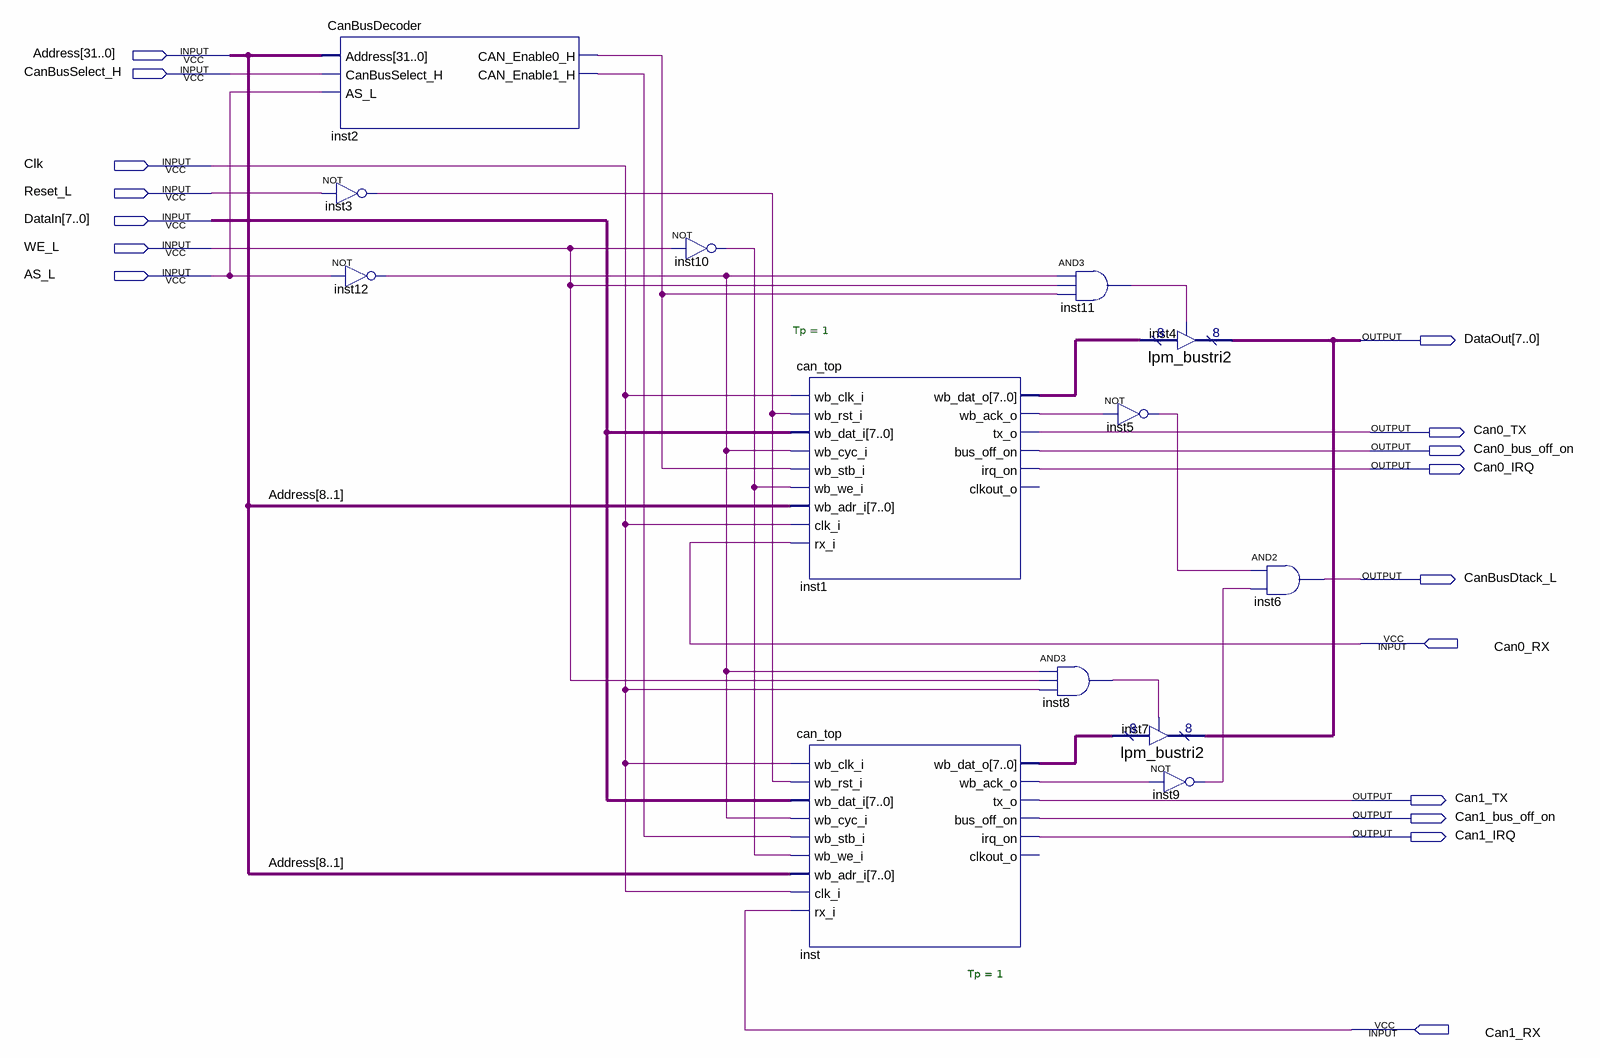
[diagram p0: schematic sheet]
// Quartus schematic CanController.bdf as structural Verilog: 13 symbols, 17 pins
module CanController (
  input  [31:0] Address,
  input  CanBusSelect_H,
  input  Clk,
  input  Reset_L,
  input  [7:0] DataIn,
  input  WE_L,
  input  AS_L,
  input  Can0_RX,
  input  Can1_RX,
  output [7:0] DataOut,
  output Can0_TX,
  output Can0_bus_off_on,
  output Can0_IRQ,
  output CanBusDtack_L,
  output Can1_TX,
  output Can1_bus_off_on,
  output Can1_IRQ
);

  wire inst1_wb_ack_o, inst2_can_enable0_h, inst2_can_enable1_h, inst3_out, inst5_out, inst8_out, inst9_out,
       inst10_out, inst11_out, inst12_out, inst_wb_ack_o;
  wire [7:0] inst1_wb_dat_o, inst_wb_dat_o;

  CanBusDecoder inst2 (
    .Address(Address), .CanBusSelect_H(CanBusSelect_H), .AS_L(AS_L), .CAN_Enable0_H(inst2_can_enable0_h),
    .CAN_Enable1_H(inst2_can_enable1_h));
  not inst3 (inst3_out, Reset_L);
  not inst12 (inst12_out, AS_L);
  not inst10 (inst10_out, WE_L);
  can_top #(.Tp(1)) inst1 (
    .wb_clk_i(Clk), .wb_rst_i(inst3_out), .wb_dat_i(DataIn), .wb_cyc_i(inst12_out),
    .wb_stb_i(inst2_can_enable0_h), .wb_we_i(inst10_out), .wb_adr_i(Address[8:1]), .clk_i(Clk),
    .rx_i(Can0_RX), .wb_dat_o(inst1_wb_dat_o), .wb_ack_o(inst1_wb_ack_o), .tx_o(Can0_TX),
    .bus_off_on(Can0_bus_off_on), .irq_on(Can0_IRQ));  // open: clkout_o
  can_top #(.Tp(1)) inst (
    .wb_clk_i(Clk), .wb_rst_i(inst3_out), .wb_dat_i(DataIn), .wb_cyc_i(inst12_out),
    .wb_stb_i(inst2_can_enable1_h), .wb_we_i(inst10_out), .wb_adr_i(Address[8:1]), .clk_i(Clk),
    .rx_i(Can1_RX), .wb_dat_o(inst_wb_dat_o), .wb_ack_o(inst_wb_ack_o), .tx_o(Can1_TX),
    .bus_off_on(Can1_bus_off_on), .irq_on(Can1_IRQ));  // open: clkout_o
  and inst11 (inst11_out, inst12_out, WE_L, inst2_can_enable0_h);
  and inst8 (inst8_out, inst12_out, WE_L, Clk);
  lpm_bustri2 inst4 (.enabledt(inst11_out), .data(inst1_wb_dat_o), .tridata(DataOut));
  not inst5 (inst5_out, inst1_wb_ack_o);
  lpm_bustri2 inst7 (.enabledt(inst8_out), .data(inst_wb_dat_o), .tridata(DataOut));
  not inst9 (inst9_out, inst_wb_ack_o);
  and inst6 (CanBusDtack_L, inst5_out, inst9_out);
endmodule
